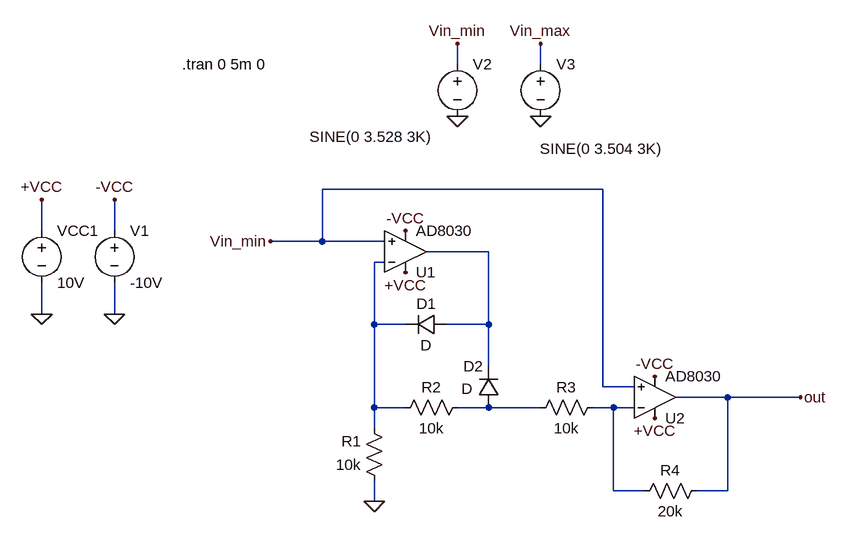
[diagram p0: schematic Trans MODIFICAT.asc]
Trans MODIFICAT.asc, the LTspice schematic file:
Version 4.1
SHEET 1 984 680
WIRE 400 -192 400 -224
WIRE 528 -192 528 -224
WIRE 624 0 192 0
WIRE -240 64 -240 16
WIRE -128 64 -128 16
WIRE 192 80 192 0
WIRE 192 80 112 80
WIRE 288 80 192 80
WIRE 448 96 352 96
WIRE 288 112 272 112
WIRE -240 192 -240 144
WIRE -128 192 -128 144
WIRE 272 208 272 112
WIRE 320 208 272 208
WIRE 448 208 448 96
WIRE 448 208 384 208
WIRE 448 272 448 208
WIRE 624 304 624 0
WIRE 672 304 624 304
WIRE 816 320 736 320
WIRE 928 320 816 320
WIRE 272 336 272 208
WIRE 320 336 272 336
WIRE 448 336 400 336
WIRE 528 336 448 336
WIRE 640 336 608 336
WIRE 672 336 640 336
WIRE 272 368 272 336
WIRE 640 464 640 336
WIRE 688 464 640 464
WIRE 816 464 816 320
WIRE 816 464 768 464
WIRE 272 480 272 448
FLAG 272 480 0
FLAG 928 320 out
FLAG -128 192 0
FLAG -240 192 0
FLAG -240 16 +VCC
FLAG -128 16 -VCC
FLAG 320 128 +VCC
FLAG 704 352 +VCC
FLAG 320 64 -VCC
FLAG 704 288 -VCC
FLAG 528 -112 0
FLAG 400 -112 0
FLAG 400 -224 Vin_min
FLAG 528 -224 Vin_max
FLAG 112 80 Vin_min
SYMBOL OpAmps\\AD8030 320 160 M180
SYMATTR InstName U1
SYMBOL OpAmps\\AD8030 704 384 M180
SYMATTR InstName U2
SYMBOL diode 384 192 R90
WINDOW 0 0 32 VBottom 2
WINDOW 3 32 32 VTop 2
SYMATTR InstName D1
SYMBOL diode 464 336 R180
WINDOW 0 24 64 Left 2
WINDOW 3 41 29 Left 2
SYMATTR InstName D2
SYMBOL res 288 464 R180
WINDOW 0 36 76 Left 2
WINDOW 3 36 40 Left 2
SYMATTR InstName R1
SYMATTR Value 10k
SYMBOL res 416 320 R90
WINDOW 0 0 56 VBottom 2
WINDOW 3 32 56 VTop 2
SYMATTR InstName R2
SYMATTR Value 10k
SYMBOL res 624 320 R90
WINDOW 0 0 56 VBottom 2
WINDOW 3 32 56 VTop 2
SYMATTR InstName R3
SYMATTR Value 10k
SYMBOL res 784 448 R90
WINDOW 0 0 56 VBottom 2
WINDOW 3 32 56 VTop 2
SYMATTR InstName R4
SYMATTR Value 20k
SYMBOL voltage -240 48 R0
WINDOW 123 0 0 Left 0
WINDOW 39 0 0 Left 0
SYMATTR InstName VCC1
SYMATTR Value 10V
SYMBOL voltage -128 48 R0
WINDOW 123 0 0 Left 0
WINDOW 39 0 0 Left 0
SYMATTR InstName V1
SYMATTR Value -10V
SYMBOL voltage 400 -208 R0
WINDOW 3 -228 127 Left 2
WINDOW 123 0 0 Left 0
WINDOW 39 0 0 Left 0
SYMATTR Value SINE(0 3.528 3K)
SYMATTR InstName V2
SYMBOL voltage 528 -208 R0
WINDOW 3 -1 146 Left 2
WINDOW 123 0 0 Left 0
WINDOW 39 0 0 Left 0
SYMATTR Value SINE(0 3.504 3K)
SYMATTR InstName V3
TEXT -24 -192 Left 2 !.tran 0 5m 0

The netlist it stands for:
* Trans MODIFICAT.asc
X§U1 Vin_min N002 +VCC -VCC N001 AD8040  ; AD8030, pins In+ In- V+ V- OUT
X§U2 Vin_min N004 +VCC -VCC out AD8040  ; AD8030, pins In+ In- V+ V- OUT
D1 N001 N002 D
D2 N003 N001 D
R1 0 N002 10k
R2 N003 N002 10k
R3 N004 N003 10k
R4 out N004 20k
VCC1 +VCC 0 10V
V1 -VCC 0 -10V
V2 Vin_min 0 SINE(0 3.528 3K)
V3 Vin_max 0 SINE(0 3.504 3K)
.model D D
.lib standard.dio
.tran 0 5m 0
.lib ADI.lib
.backanno
.end